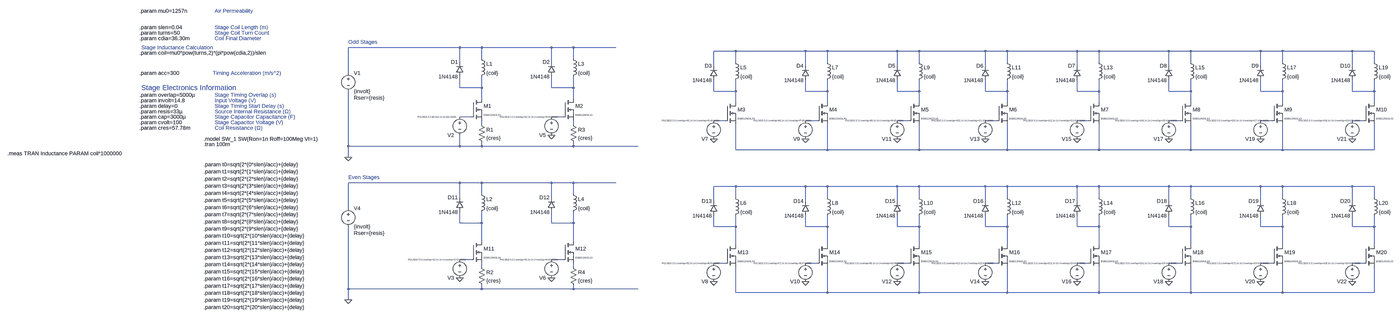
[diagram p0: schematic coilgun4-nmos.asc, whole sheet]
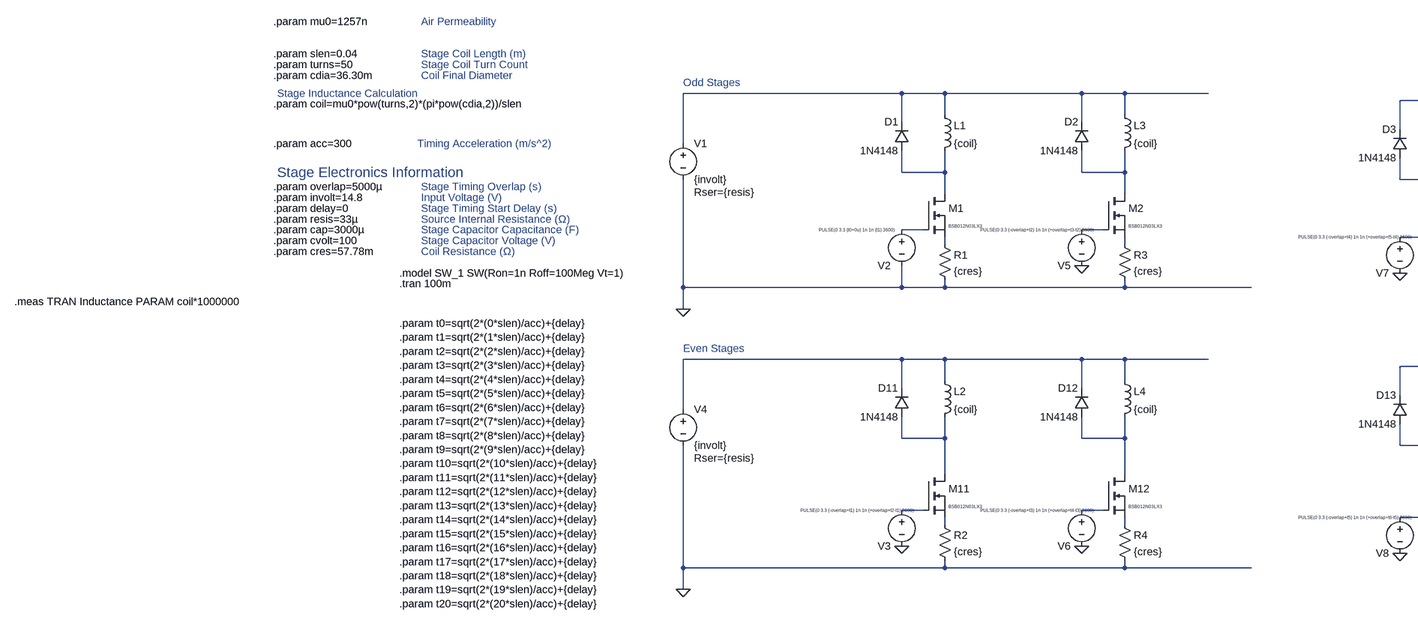
[diagram p1: schematic coilgun4-nmos.asc, part, row 1 of 1, column 1 of 2]
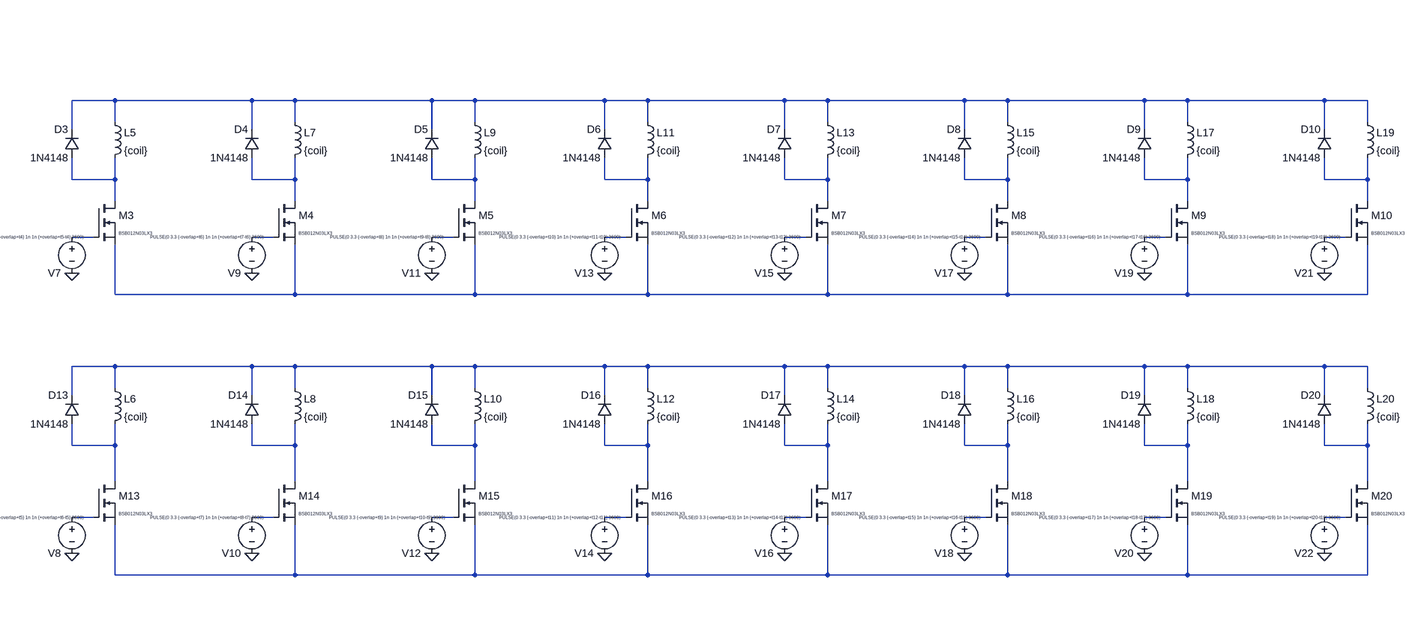
[diagram p2: schematic coilgun4-nmos.asc, part, row 1 of 1, column 2 of 2]
coilgun4-nmos.asc, the LTspice schematic file:
Version 4.1
SHEET 1 8016 1416
WIRE 288 -160 -288 -160
WIRE 384 -160 288 -160
WIRE 688 -160 384 -160
WIRE 784 -160 688 -160
WIRE 1088 -160 784 -160
WIRE 1968 -144 1872 -144
WIRE 2272 -144 1968 -144
WIRE 2368 -144 2272 -144
WIRE 2672 -144 2368 -144
WIRE 2768 -144 2672 -144
WIRE 3056 -144 2768 -144
WIRE 3152 -144 3056 -144
WIRE 3456 -144 3152 -144
WIRE 3552 -144 3456 -144
WIRE 3856 -144 3552 -144
WIRE 3952 -144 3856 -144
WIRE 4256 -144 3952 -144
WIRE 4352 -144 4256 -144
WIRE 4656 -144 4352 -144
WIRE 4752 -144 4656 -144
WIRE 384 -112 384 -160
WIRE 784 -112 784 -160
WIRE 288 -96 288 -160
WIRE 688 -96 688 -160
WIRE 1968 -96 1968 -144
WIRE 2368 -96 2368 -144
WIRE 2768 -96 2768 -144
WIRE 3152 -96 3152 -144
WIRE 3552 -96 3552 -144
WIRE 3952 -96 3952 -144
WIRE 4352 -96 4352 -144
WIRE 4752 -96 4752 -144
WIRE 1872 -80 1872 -144
WIRE 2272 -80 2272 -144
WIRE 2672 -80 2672 -144
WIRE 3056 -80 3056 -144
WIRE 3456 -80 3456 -144
WIRE 3856 -80 3856 -144
WIRE 4256 -80 4256 -144
WIRE 4656 -80 4656 -144
WIRE -288 -48 -288 -160
WIRE 288 16 288 -32
WIRE 384 16 384 -32
WIRE 384 16 288 16
WIRE 688 16 688 -32
WIRE 784 16 784 -32
WIRE 784 16 688 16
WIRE 1872 32 1872 -16
WIRE 1968 32 1968 -16
WIRE 1968 32 1872 32
WIRE 2272 32 2272 -16
WIRE 2368 32 2368 -16
WIRE 2368 32 2272 32
WIRE 2672 32 2672 -16
WIRE 2768 32 2768 -16
WIRE 2768 32 2672 32
WIRE 3056 32 3056 -16
WIRE 3152 32 3152 -16
WIRE 3152 32 3056 32
WIRE 3456 32 3456 -16
WIRE 3552 32 3552 -16
WIRE 3552 32 3456 32
WIRE 3856 32 3856 -16
WIRE 3952 32 3952 -16
WIRE 3952 32 3856 32
WIRE 4256 32 4256 -16
WIRE 4352 32 4352 -16
WIRE 4352 32 4256 32
WIRE 4656 32 4656 -16
WIRE 4752 32 4752 -16
WIRE 4752 32 4656 32
WIRE 384 64 384 16
WIRE 784 64 784 16
WIRE 1968 80 1968 32
WIRE 2368 80 2368 32
WIRE 2768 80 2768 32
WIRE 3152 80 3152 32
WIRE 3552 80 3552 32
WIRE 3952 80 3952 32
WIRE 4352 80 4352 32
WIRE 4752 80 4752 32
WIRE 336 144 288 144
WIRE 736 144 688 144
WIRE 1920 160 1872 160
WIRE 2320 160 2272 160
WIRE 2720 160 2672 160
WIRE 3104 160 3056 160
WIRE 3504 160 3456 160
WIRE 3904 160 3856 160
WIRE 4304 160 4256 160
WIRE 4704 160 4656 160
WIRE 384 176 384 160
WIRE 784 176 784 160
WIRE -288 272 -288 32
WIRE 288 272 288 224
WIRE 288 272 -288 272
WIRE 384 272 384 256
WIRE 384 272 288 272
WIRE 784 272 784 256
WIRE 784 272 384 272
WIRE 1184 272 784 272
WIRE 1968 288 1968 176
WIRE 2368 288 2368 176
WIRE 2368 288 1968 288
WIRE 2768 288 2768 176
WIRE 2768 288 2368 288
WIRE 3152 288 3152 176
WIRE 3152 288 2768 288
WIRE 3552 288 3552 176
WIRE 3552 288 3152 288
WIRE 3952 288 3952 176
WIRE 3952 288 3552 288
WIRE 4352 288 4352 176
WIRE 4352 288 3952 288
WIRE 4752 288 4752 176
WIRE 4752 288 4352 288
WIRE -288 320 -288 272
WIRE 288 432 -288 432
WIRE 384 432 288 432
WIRE 688 432 384 432
WIRE 784 432 688 432
WIRE 1088 432 784 432
WIRE 1968 448 1872 448
WIRE 2272 448 1968 448
WIRE 2368 448 2272 448
WIRE 2672 448 2368 448
WIRE 2768 448 2672 448
WIRE 3056 448 2768 448
WIRE 3152 448 3056 448
WIRE 3456 448 3152 448
WIRE 3552 448 3456 448
WIRE 3856 448 3552 448
WIRE 3952 448 3856 448
WIRE 4256 448 3952 448
WIRE 4352 448 4256 448
WIRE 4656 448 4352 448
WIRE 4752 448 4656 448
WIRE 384 480 384 432
WIRE 784 480 784 432
WIRE 288 496 288 432
WIRE 688 496 688 432
WIRE 1968 496 1968 448
WIRE 2368 496 2368 448
WIRE 2768 496 2768 448
WIRE 3152 496 3152 448
WIRE 3552 496 3552 448
WIRE 3952 496 3952 448
WIRE 4352 496 4352 448
WIRE 4752 496 4752 448
WIRE 1872 512 1872 448
WIRE 2272 512 2272 448
WIRE 2672 512 2672 448
WIRE 3056 512 3056 448
WIRE 3456 512 3456 448
WIRE 3856 512 3856 448
WIRE 4256 512 4256 448
WIRE 4656 512 4656 448
WIRE -288 544 -288 432
WIRE 288 608 288 560
WIRE 384 608 384 560
WIRE 384 608 288 608
WIRE 688 608 688 560
WIRE 784 608 784 560
WIRE 784 608 688 608
WIRE 1872 624 1872 576
WIRE 1968 624 1968 576
WIRE 1968 624 1872 624
WIRE 2272 624 2272 576
WIRE 2368 624 2368 576
WIRE 2368 624 2272 624
WIRE 2672 624 2672 576
WIRE 2768 624 2768 576
WIRE 2768 624 2672 624
WIRE 3056 624 3056 576
WIRE 3152 624 3152 576
WIRE 3152 624 3056 624
WIRE 3456 624 3456 576
WIRE 3552 624 3552 576
WIRE 3552 624 3456 624
WIRE 3856 624 3856 576
WIRE 3952 624 3952 576
WIRE 3952 624 3856 624
WIRE 4256 624 4256 576
WIRE 4352 624 4352 576
WIRE 4352 624 4256 624
WIRE 4656 624 4656 576
WIRE 4752 624 4752 576
WIRE 4752 624 4656 624
WIRE 384 688 384 608
WIRE 784 688 784 608
WIRE 1968 704 1968 624
WIRE 2368 704 2368 624
WIRE 2768 704 2768 624
WIRE 3152 704 3152 624
WIRE 3552 704 3552 624
WIRE 3952 704 3952 624
WIRE 4352 704 4352 624
WIRE 4752 704 4752 624
WIRE 336 768 288 768
WIRE 736 768 688 768
WIRE 1920 784 1872 784
WIRE 2320 784 2272 784
WIRE 2720 784 2672 784
WIRE 3104 784 3056 784
WIRE 3504 784 3456 784
WIRE 3904 784 3856 784
WIRE 4304 784 4256 784
WIRE 4704 784 4656 784
WIRE 384 800 384 784
WIRE 784 800 784 784
WIRE -288 896 -288 624
WIRE 384 896 384 880
WIRE 384 896 -288 896
WIRE 784 896 784 880
WIRE 784 896 384 896
WIRE 1184 896 784 896
WIRE 1968 912 1968 800
WIRE 2368 912 2368 800
WIRE 2368 912 1968 912
WIRE 2768 912 2768 800
WIRE 2768 912 2368 912
WIRE 3152 912 3152 800
WIRE 3152 912 2768 912
WIRE 3552 912 3552 800
WIRE 3552 912 3152 912
WIRE 3952 912 3952 800
WIRE 3952 912 3552 912
WIRE 4352 912 4352 800
WIRE 4352 912 3952 912
WIRE 4752 912 4752 800
WIRE 4752 912 4352 912
WIRE -288 944 -288 896
FLAG -288 320 0
FLAG -288 944 0
FLAG 688 224 0
FLAG 1872 240 0
FLAG 2272 240 0
FLAG 2672 240 0
FLAG 3056 240 0
FLAG 3456 240 0
FLAG 3856 240 0
FLAG 4256 240 0
FLAG 4656 240 0
FLAG 288 848 0
FLAG 688 848 0
FLAG 1872 864 0
FLAG 2272 864 0
FLAG 2672 864 0
FLAG 3056 864 0
FLAG 3456 864 0
FLAG 3856 864 0
FLAG 4256 864 0
FLAG 4656 864 0
SYMBOL voltage -288 -64 R0
WINDOW 123 0 0 Left 0
WINDOW 39 24 124 Left 2
SYMATTR SpiceLine Rser={resis}
SYMATTR InstName V1
SYMATTR Value {involt}
SYMBOL ind 368 -128 R0
SYMATTR InstName L1
SYMATTR Value {coil}
SYMBOL voltage 288 128 M0
WINDOW 0 24 96 Left 2
WINDOW 3 100 10 Top 0
WINDOW 123 0 0 Left 0
WINDOW 39 0 0 Left 0
SYMATTR InstName V2
SYMATTR Value PULSE(0 3.3 {t0+0u} 1n 1n {t1} 3600)
SYMBOL voltage 288 752 M0
WINDOW 0 24 96 Left 2
WINDOW 3 100 10 Top 0
WINDOW 123 0 0 Left 0
WINDOW 39 0 0 Left 0
SYMATTR InstName V3
SYMATTR Value PULSE(0 3.3 {-overlap+t1} 1n 1n {+overlap+t2-t1} 3600)
SYMBOL voltage -288 528 R0
WINDOW 123 0 0 Left 0
WINDOW 39 24 124 Left 2
SYMATTR SpiceLine Rser={resis}
SYMATTR InstName V4
SYMATTR Value {involt}
SYMBOL voltage 688 128 M0
WINDOW 0 24 96 Left 2
WINDOW 3 100 10 Top 0
WINDOW 123 0 0 Left 0
WINDOW 39 0 0 Left 0
SYMATTR InstName V5
SYMATTR Value PULSE(0 3.3 {-overlap+t2} 1n 1n {+overlap+t3-t2} 3600)
SYMBOL voltage 688 752 M0
WINDOW 0 24 96 Left 2
WINDOW 3 100 10 Top 0
WINDOW 123 0 0 Left 0
WINDOW 39 0 0 Left 0
SYMATTR InstName V6
SYMATTR Value PULSE(0 3.3 {-overlap+t3} 1n 1n {+overlap+t4-t3} 3600)
SYMBOL voltage 1872 144 M0
WINDOW 0 24 96 Left 2
WINDOW 3 100 10 Top 0
WINDOW 123 0 0 Left 0
WINDOW 39 0 0 Left 0
SYMATTR InstName V7
SYMATTR Value PULSE(0 3.3 {-overlap+t4} 1n 1n {+overlap+t5-t4} 3600)
SYMBOL voltage 1872 768 M0
WINDOW 0 24 96 Left 2
WINDOW 3 100 10 Top 0
WINDOW 123 0 0 Left 0
WINDOW 39 0 0 Left 0
SYMATTR InstName V8
SYMATTR Value PULSE(0 3.3 {-overlap+t5} 1n 1n {+overlap+t6-t5} 3600)
SYMBOL voltage 2272 144 M0
WINDOW 0 24 96 Left 2
WINDOW 3 100 10 Top 0
WINDOW 123 0 0 Left 0
WINDOW 39 0 0 Left 0
SYMATTR InstName V9
SYMATTR Value PULSE(0 3.3 {-overlap+t6} 1n 1n {+overlap+t7-t6} 3600)
SYMBOL voltage 2272 768 M0
WINDOW 0 24 96 Left 2
WINDOW 3 100 10 Top 0
WINDOW 123 0 0 Left 0
WINDOW 39 0 0 Left 0
SYMATTR InstName V10
SYMATTR Value PULSE(0 3.3 {-overlap+t7} 1n 1n {+overlap+t8-t7} 3600)
SYMBOL voltage 2672 144 M0
WINDOW 0 24 96 Left 2
WINDOW 3 100 10 Top 0
WINDOW 123 0 0 Left 0
WINDOW 39 0 0 Left 0
SYMATTR InstName V11
SYMATTR Value PULSE(0 3.3 {-overlap+t8} 1n 1n {+overlap+t9-t8} 3600)
SYMBOL voltage 2672 768 M0
WINDOW 0 24 96 Left 2
WINDOW 3 100 10 Top 0
WINDOW 123 0 0 Left 0
WINDOW 39 0 0 Left 0
SYMATTR InstName V12
SYMATTR Value PULSE(0 3.3 {-overlap+t9} 1n 1n {+overlap+t10-t9} 3600)
SYMBOL voltage 3056 144 M0
WINDOW 0 24 96 Left 2
WINDOW 3 100 10 Top 0
WINDOW 123 0 0 Left 0
WINDOW 39 0 0 Left 0
SYMATTR InstName V13
SYMATTR Value PULSE(0 3.3 {-overlap+t10} 1n 1n {+overlap+t11-t10} 3600)
SYMBOL voltage 3056 768 M0
WINDOW 0 24 96 Left 2
WINDOW 3 100 10 Top 0
WINDOW 123 0 0 Left 0
WINDOW 39 0 0 Left 0
SYMATTR InstName V14
SYMATTR Value PULSE(0 3.3 {-overlap+t11} 1n 1n {+overlap+t12-t11} 3600)
SYMBOL voltage 3456 144 M0
WINDOW 0 24 96 Left 2
WINDOW 3 100 10 Top 0
WINDOW 123 0 0 Left 0
WINDOW 39 0 0 Left 0
SYMATTR InstName V15
SYMATTR Value PULSE(0 3.3 {-overlap+t12} 1n 1n {+overlap+t13-t12} 3600)
SYMBOL voltage 3456 768 M0
WINDOW 0 24 96 Left 2
WINDOW 3 100 10 Top 0
WINDOW 123 0 0 Left 0
WINDOW 39 0 0 Left 0
SYMATTR InstName V16
SYMATTR Value PULSE(0 3.3 {-overlap+t13} 1n 1n {+overlap+t14-t13} 3600)
SYMBOL voltage 3856 144 M0
WINDOW 0 24 96 Left 2
WINDOW 3 100 10 Top 0
WINDOW 123 0 0 Left 0
WINDOW 39 0 0 Left 0
SYMATTR InstName V17
SYMATTR Value PULSE(0 3.3 {-overlap+t14} 1n 1n {+overlap+t15-t14} 3600)
SYMBOL voltage 3856 768 M0
WINDOW 0 24 96 Left 2
WINDOW 3 100 10 Top 0
WINDOW 123 0 0 Left 0
WINDOW 39 0 0 Left 0
SYMATTR InstName V18
SYMATTR Value PULSE(0 3.3 {-overlap+t15} 1n 1n {+overlap+t16-t15} 3600)
SYMBOL voltage 4256 144 M0
WINDOW 0 24 96 Left 2
WINDOW 3 100 10 Top 0
WINDOW 123 0 0 Left 0
WINDOW 39 0 0 Left 0
SYMATTR InstName V19
SYMATTR Value PULSE(0 3.3 {-overlap+t16} 1n 1n {+overlap+t17-t16} 3600)
SYMBOL voltage 4256 768 M0
WINDOW 0 24 96 Left 2
WINDOW 3 100 10 Top 0
WINDOW 123 0 0 Left 0
WINDOW 39 0 0 Left 0
SYMATTR InstName V20
SYMATTR Value PULSE(0 3.3 {-overlap+t17} 1n 1n {+overlap+t18-t17} 3600)
SYMBOL voltage 4656 144 M0
WINDOW 0 24 96 Left 2
WINDOW 3 100 10 Top 0
WINDOW 123 0 0 Left 0
WINDOW 39 0 0 Left 0
SYMATTR InstName V21
SYMATTR Value PULSE(0 3.3 {-overlap+t18} 1n 1n {+overlap+t19-t18} 3600)
SYMBOL voltage 4656 768 M0
WINDOW 0 24 96 Left 2
WINDOW 3 100 10 Top 0
WINDOW 123 0 0 Left 0
WINDOW 39 0 0 Left 0
SYMATTR InstName V22
SYMATTR Value PULSE(0 3.3 {-overlap+t19} 1n 1n {+overlap+t20-t19} 3600)
SYMBOL nmos 336 64 R0
WINDOW 3 56 72 Left 0
SYMATTR Value BSB012N03LX3
SYMATTR InstName M1
SYMBOL ind 768 -128 R0
SYMATTR InstName L3
SYMATTR Value {coil}
SYMBOL nmos 736 64 R0
WINDOW 3 56 72 Left 0
SYMATTR Value BSB012N03LX3
SYMATTR InstName M2
SYMBOL nmos 1920 80 R0
WINDOW 3 56 72 Left 0
SYMATTR Value BSB012N03LX3
SYMATTR InstName M3
SYMBOL nmos 2320 80 R0
WINDOW 3 56 72 Left 0
SYMATTR Value BSB012N03LX3
SYMATTR InstName M4
SYMBOL nmos 2720 80 R0
WINDOW 3 56 72 Left 0
SYMATTR Value BSB012N03LX3
SYMATTR InstName M5
SYMBOL nmos 3104 80 R0
WINDOW 3 56 72 Left 0
SYMATTR Value BSB012N03LX3
SYMATTR InstName M6
SYMBOL nmos 3504 80 R0
WINDOW 3 56 72 Left 0
SYMATTR Value BSB012N03LX3
SYMATTR InstName M7
SYMBOL nmos 3904 80 R0
WINDOW 3 56 72 Left 0
SYMATTR Value BSB012N03LX3
SYMATTR InstName M8
SYMBOL nmos 4304 80 R0
WINDOW 3 56 72 Left 0
SYMATTR Value BSB012N03LX3
SYMATTR InstName M9
SYMBOL nmos 4704 80 R0
WINDOW 3 56 72 Left 0
SYMATTR Value BSB012N03LX3
SYMATTR InstName M10
SYMBOL diode 304 -32 R180
WINDOW 0 24 64 Left 2
WINDOW 3 24 0 Left 2
SYMATTR InstName D1
SYMATTR Value 1N4148
SYMBOL diode 704 -32 R180
WINDOW 0 24 64 Left 2
WINDOW 3 24 0 Left 2
SYMATTR InstName D2
SYMATTR Value 1N4148
SYMBOL diode 1888 -16 R180
WINDOW 0 24 64 Left 2
WINDOW 3 24 0 Left 2
SYMATTR InstName D3
SYMATTR Value 1N4148
SYMBOL diode 2288 -16 R180
WINDOW 0 24 64 Left 2
WINDOW 3 24 0 Left 2
SYMATTR InstName D4
SYMATTR Value 1N4148
SYMBOL diode 2688 -16 R180
WINDOW 0 24 64 Left 2
WINDOW 3 24 0 Left 2
SYMATTR InstName D5
SYMATTR Value 1N4148
SYMBOL diode 3072 -16 R180
WINDOW 0 24 64 Left 2
WINDOW 3 24 0 Left 2
SYMATTR InstName D6
SYMATTR Value 1N4148
SYMBOL diode 3472 -16 R180
WINDOW 0 24 64 Left 2
WINDOW 3 24 0 Left 2
SYMATTR InstName D7
SYMATTR Value 1N4148
SYMBOL diode 3872 -16 R180
WINDOW 0 24 64 Left 2
WINDOW 3 24 0 Left 2
SYMATTR InstName D8
SYMATTR Value 1N4148
SYMBOL diode 4272 -16 R180
WINDOW 0 24 64 Left 2
WINDOW 3 24 0 Left 2
SYMATTR InstName D9
SYMATTR Value 1N4148
SYMBOL diode 4672 -16 R180
WINDOW 0 24 64 Left 2
WINDOW 3 24 0 Left 2
SYMATTR InstName D10
SYMATTR Value 1N4148
SYMBOL nmos 336 688 R0
WINDOW 3 56 72 Left 0
SYMATTR Value BSB012N03LX3
SYMATTR InstName M11
SYMBOL nmos 736 688 R0
WINDOW 3 56 72 Left 0
SYMATTR Value BSB012N03LX3
SYMATTR InstName M12
SYMBOL nmos 1920 704 R0
WINDOW 3 56 72 Left 0
SYMATTR Value BSB012N03LX3
SYMATTR InstName M13
SYMBOL nmos 2320 704 R0
WINDOW 3 56 72 Left 0
SYMATTR Value BSB012N03LX3
SYMATTR InstName M14
SYMBOL nmos 2720 704 R0
WINDOW 3 56 72 Left 0
SYMATTR Value BSB012N03LX3
SYMATTR InstName M15
SYMBOL nmos 3104 704 R0
WINDOW 3 56 72 Left 0
SYMATTR Value BSB012N03LX3
SYMATTR InstName M16
SYMBOL nmos 3504 704 R0
WINDOW 3 56 72 Left 0
SYMATTR Value BSB012N03LX3
SYMATTR InstName M17
SYMBOL nmos 3904 704 R0
WINDOW 3 56 72 Left 0
SYMATTR Value BSB012N03LX3
SYMATTR InstName M18
SYMBOL nmos 4304 704 R0
WINDOW 3 56 72 Left 0
SYMATTR Value BSB012N03LX3
SYMATTR InstName M19
SYMBOL nmos 4704 704 R0
WINDOW 3 56 72 Left 0
SYMATTR Value BSB012N03LX3
SYMATTR InstName M20
SYMBOL diode 304 560 R180
WINDOW 0 24 64 Left 2
WINDOW 3 24 0 Left 2
SYMATTR InstName D11
SYMATTR Value 1N4148
SYMBOL diode 704 560 R180
WINDOW 0 24 64 Left 2
WINDOW 3 24 0 Left 2
SYMATTR InstName D12
SYMATTR Value 1N4148
SYMBOL diode 1888 576 R180
WINDOW 0 24 64 Left 2
WINDOW 3 24 0 Left 2
SYMATTR InstName D13
SYMATTR Value 1N4148
SYMBOL diode 2288 576 R180
WINDOW 0 24 64 Left 2
WINDOW 3 24 0 Left 2
SYMATTR InstName D14
SYMATTR Value 1N4148
SYMBOL diode 2688 576 R180
WINDOW 0 24 64 Left 2
WINDOW 3 24 0 Left 2
SYMATTR InstName D15
SYMATTR Value 1N4148
SYMBOL diode 3072 576 R180
WINDOW 0 24 64 Left 2
WINDOW 3 24 0 Left 2
SYMATTR InstName D16
SYMATTR Value 1N4148
SYMBOL diode 3472 576 R180
WINDOW 0 24 64 Left 2
WINDOW 3 24 0 Left 2
SYMATTR InstName D17
SYMATTR Value 1N4148
SYMBOL diode 3872 576 R180
WINDOW 0 24 64 Left 2
WINDOW 3 24 0 Left 2
SYMATTR InstName D18
SYMATTR Value 1N4148
SYMBOL diode 4272 576 R180
WINDOW 0 24 64 Left 2
WINDOW 3 24 0 Left 2
SYMATTR InstName D19
SYMATTR Value 1N4148
SYMBOL diode 4672 576 R180
WINDOW 0 24 64 Left 2
WINDOW 3 24 0 Left 2
SYMATTR InstName D20
SYMATTR Value 1N4148
SYMBOL ind 1952 -112 R0
SYMATTR InstName L5
SYMATTR Value {coil}
SYMBOL ind 2352 -112 R0
SYMATTR InstName L7
SYMATTR Value {coil}
SYMBOL ind 2752 -112 R0
SYMATTR InstName L9
SYMATTR Value {coil}
SYMBOL ind 3136 -112 R0
SYMATTR InstName L11
SYMATTR Value {coil}
SYMBOL ind 3536 -112 R0
SYMATTR InstName L13
SYMATTR Value {coil}
SYMBOL ind 3936 -112 R0
SYMATTR InstName L15
SYMATTR Value {coil}
SYMBOL ind 4336 -112 R0
SYMATTR InstName L17
SYMATTR Value {coil}
SYMBOL ind 4736 -112 R0
SYMATTR InstName L19
SYMATTR Value {coil}
SYMBOL ind 368 464 R0
SYMATTR InstName L2
SYMATTR Value {coil}
SYMBOL ind 768 464 R0
SYMATTR InstName L4
SYMATTR Value {coil}
SYMBOL ind 1952 480 R0
SYMATTR InstName L6
SYMATTR Value {coil}
SYMBOL ind 2352 480 R0
SYMATTR InstName L8
SYMATTR Value {coil}
SYMBOL ind 2752 480 R0
SYMATTR InstName L10
SYMATTR Value {coil}
SYMBOL ind 3136 480 R0
SYMATTR InstName L12
SYMATTR Value {coil}
SYMBOL ind 3536 480 R0
SYMATTR InstName L14
SYMATTR Value {coil}
SYMBOL ind 3936 480 R0
SYMATTR InstName L16
SYMATTR Value {coil}
SYMBOL ind 4336 480 R0
SYMATTR InstName L18
SYMATTR Value {coil}
SYMBOL ind 4736 480 R0
SYMATTR InstName L20
SYMATTR Value {coil}
SYMBOL res 368 160 R0
SYMATTR InstName R1
SYMATTR Value {cres}
SYMBOL res 368 784 R0
SYMATTR InstName R2
SYMATTR Value {cres}
SYMBOL res 768 160 R0
SYMATTR InstName R3
SYMATTR Value {cres}
SYMBOL res 768 784 R0
SYMATTR InstName R4
SYMATTR Value {cres}
TEXT -288 -184 Left 2 ;Odd Stages
TEXT -288 408 Left 2 ;Even Stages
TEXT -1112 264 Left 2 !.tran 100m
TEXT -1112 240 Left 2 !.model SW_1 SW(Ron=1n Roff=100Meg Vt=1)
TEXT -1392 -136 Left 2 !.param coil=mu0*pow(turns,2)*(pi*pow(cdia,2))/slen
TEXT -1112 352 Left 2 !.param t0=sqrt(2*(0*slen)/acc)+{delay}\n.param t1=sqrt(2*(1*slen)/acc)+{delay}\n.param t2=sqrt(2*(2*slen)/acc)+{delay}\n.param t3=sqrt(2*(3*slen)/acc)+{delay}\n.param t4=sqrt(2*(4*slen)/acc)+{delay}\n.param t5=sqrt(2*(5*slen)/acc)+{delay}\n.param t6=sqrt(2*(6*slen)/acc)+{delay}\n.param t7=sqrt(2*(7*slen)/acc)+{delay}\n.param t8=sqrt(2*(8*slen)/acc)+{delay}\n.param t9=sqrt(2*(9*slen)/acc)+{delay}\n.param t10=sqrt(2*(10*slen)/acc)+{delay}\n.param t11=sqrt(2*(11*slen)/acc)+{delay}\n.param t12=sqrt(2*(12*slen)/acc)+{delay}\n.param t13=sqrt(2*(13*slen)/acc)+{delay}\n.param t14=sqrt(2*(14*slen)/acc)+{delay}\n.param t15=sqrt(2*(15*slen)/acc)+{delay}\n.param t16=sqrt(2*(16*slen)/acc)+{delay}\n.param t17=sqrt(2*(17*slen)/acc)+{delay}\n.param t18=sqrt(2*(18*slen)/acc)+{delay}\n.param t19=sqrt(2*(19*slen)/acc)+{delay}\n.param t20=sqrt(2*(20*slen)/acc)+{delay}
TEXT -1392 -48 Left 2 !.param acc=300
TEXT -1392 -248 Left 2 !.param slen=0.04
TEXT -1392 48 Left 2 !.param overlap=5000µ
TEXT -1392 72 Left 2 !.param involt=14.8
TEXT -1392 -320 Left 2 !.param mu0=1257n
TEXT -1968 304 Left 2 !.meas TRAN Inductance PARAM coil*1000000
TEXT -1392 96 Left 2 !.param delay=0
TEXT -1392 120 Left 2 !.param resis=33µ
TEXT -1392 144 Left 2 !.param cap=3000µ
TEXT -1064 48 Left 2 ;Stage Timing Overlap (s)
TEXT -1064 72 Left 2 ;Input Voltage (V)
TEXT -1064 96 Left 2 ;Stage Timing Start Delay (s)
TEXT -1064 120 Left 2 ;Source Internal Resistance (Ω)
TEXT -1064 144 Left 2 ;Stage Capacitor Capacitance (F)
TEXT -1064 -320 Left 2 ;Air Permeability
TEXT -1064 -248 Left 2 ;Stage Coil Length (m)
TEXT -1384 16 Left 3 ;Stage Electronics Information
TEXT -1064 -224 Left 2 ;Stage Coil Turn Count
TEXT -1072 -48 Left 2 ;Timing Acceleration (m/s^2)
TEXT -1392 -224 Left 2 !.param turns=50
TEXT -1392 -200 Left 2 !.param cdia=36.30m
TEXT -1384 -160 Left 2 ;Stage Inductance Calculation
TEXT -1064 -200 Left 2 ;Coil Final Diameter
TEXT -1392 192 Left 2 !.param cres=57.78m
TEXT -1064 192 Left 2 ;Coil Resistance (Ω)
TEXT -1392 168 Left 2 !.param cvolt=100
TEXT -1064 168 Left 2 ;Stage Capacitor Voltage (V)

The netlist it stands for:
* coilgun4-nmos.asc
V1 N001 0 {involt} Rser={resis}
L1 N001 N003 {coil}
V2 N013 0 PULSE(0 3.3 {t0+0u} 1n 1n {t1} 3600)
V3 N038 0 PULSE(0 3.3 {-overlap+t1} 1n 1n {+overlap+t2-t1} 3600)
V4 N026 0 {involt} Rser={resis}
V5 N014 0 PULSE(0 3.3 {-overlap+t2} 1n 1n {+overlap+t3-t2} 3600)
V6 N039 0 PULSE(0 3.3 {-overlap+t3} 1n 1n {+overlap+t4-t3} 3600)
V7 N015 0 PULSE(0 3.3 {-overlap+t4} 1n 1n {+overlap+t5-t4} 3600)
V8 N040 0 PULSE(0 3.3 {-overlap+t5} 1n 1n {+overlap+t6-t5} 3600)
V9 N016 0 PULSE(0 3.3 {-overlap+t6} 1n 1n {+overlap+t7-t6} 3600)
V10 N041 0 PULSE(0 3.3 {-overlap+t7} 1n 1n {+overlap+t8-t7} 3600)
V11 N017 0 PULSE(0 3.3 {-overlap+t8} 1n 1n {+overlap+t9-t8} 3600)
V12 N042 0 PULSE(0 3.3 {-overlap+t9} 1n 1n {+overlap+t10-t9} 3600)
V13 N018 0 PULSE(0 3.3 {-overlap+t10} 1n 1n {+overlap+t11-t10} 3600)
V14 N043 0 PULSE(0 3.3 {-overlap+t11} 1n 1n {+overlap+t12-t11} 3600)
V15 N019 0 PULSE(0 3.3 {-overlap+t12} 1n 1n {+overlap+t13-t12} 3600)
V16 N044 0 PULSE(0 3.3 {-overlap+t13} 1n 1n {+overlap+t14-t13} 3600)
V17 N020 0 PULSE(0 3.3 {-overlap+t14} 1n 1n {+overlap+t15-t14} 3600)
V18 N045 0 PULSE(0 3.3 {-overlap+t15} 1n 1n {+overlap+t16-t15} 3600)
V19 N021 0 PULSE(0 3.3 {-overlap+t16} 1n 1n {+overlap+t17-t16} 3600)
V20 N046 0 PULSE(0 3.3 {-overlap+t17} 1n 1n {+overlap+t18-t17} 3600)
V21 N022 0 PULSE(0 3.3 {-overlap+t18} 1n 1n {+overlap+t19-t18} 3600)
V22 N047 0 PULSE(0 3.3 {-overlap+t19} 1n 1n {+overlap+t20-t19} 3600)
M1 N003 N013 N023 N023 BSB012N03LX3
L3 N001 N004 {coil}
M2 N004 N014 N024 N024 BSB012N03LX3
M3 N005 N015 N025 N025 BSB012N03LX3
M4 N006 N016 N025 N025 BSB012N03LX3
M5 N007 N017 N025 N025 BSB012N03LX3
M6 N008 N018 N025 N025 BSB012N03LX3
M7 N009 N019 N025 N025 BSB012N03LX3
M8 N010 N020 N025 N025 BSB012N03LX3
M9 N011 N021 N025 N025 BSB012N03LX3
M10 N012 N022 N025 N025 BSB012N03LX3
D1 N003 N001 1N4148
D2 N004 N001 1N4148
D3 N005 N002 1N4148
D4 N006 N002 1N4148
D5 N007 N002 1N4148
D6 N008 N002 1N4148
D7 N009 N002 1N4148
D8 N010 N002 1N4148
D9 N011 N002 1N4148
D10 N012 N002 1N4148
M11 N028 N038 N048 N048 BSB012N03LX3
M12 N029 N039 N049 N049 BSB012N03LX3
M13 N030 N040 N050 N050 BSB012N03LX3
M14 N031 N041 N050 N050 BSB012N03LX3
M15 N032 N042 N050 N050 BSB012N03LX3
M16 N033 N043 N050 N050 BSB012N03LX3
M17 N034 N044 N050 N050 BSB012N03LX3
M18 N035 N045 N050 N050 BSB012N03LX3
M19 N036 N046 N050 N050 BSB012N03LX3
M20 N037 N047 N050 N050 BSB012N03LX3
D11 N028 N026 1N4148
D12 N029 N026 1N4148
D13 N030 N027 1N4148
D14 N031 N027 1N4148
D15 N032 N027 1N4148
D16 N033 N027 1N4148
D17 N034 N027 1N4148
D18 N035 N027 1N4148
D19 N036 N027 1N4148
D20 N037 N027 1N4148
L5 N002 N005 {coil}
L7 N002 N006 {coil}
L9 N002 N007 {coil}
L11 N002 N008 {coil}
L13 N002 N009 {coil}
L15 N002 N010 {coil}
L17 N002 N011 {coil}
L19 N002 N012 {coil}
L2 N026 N028 {coil}
L4 N026 N029 {coil}
L6 N027 N030 {coil}
L8 N027 N031 {coil}
L10 N027 N032 {coil}
L12 N027 N033 {coil}
L14 N027 N034 {coil}
L16 N027 N035 {coil}
L18 N027 N036 {coil}
L20 N027 N037 {coil}
R1 N023 0 {cres}
R2 N048 0 {cres}
R3 N024 0 {cres}
R4 N049 0 {cres}
.model D D
.lib standard.dio
.model NMOS NMOS
.model PMOS PMOS
.lib standard.mos
* Odd Stages
* Even Stages
.tran 100m
.model SW_1 SW(Ron=1n Roff=100Meg Vt=1)
.param coil=mu0*pow(turns,2)*(pi*pow(cdia,2))/slen
.param t0=sqrt(2*(0*slen)/acc)+{delay}
.param t1=sqrt(2*(1*slen)/acc)+{delay}
.param t2=sqrt(2*(2*slen)/acc)+{delay}
.param t3=sqrt(2*(3*slen)/acc)+{delay}
.param t4=sqrt(2*(4*slen)/acc)+{delay}
.param t5=sqrt(2*(5*slen)/acc)+{delay}
.param t6=sqrt(2*(6*slen)/acc)+{delay}
.param t7=sqrt(2*(7*slen)/acc)+{delay}
.param t8=sqrt(2*(8*slen)/acc)+{delay}
.param t9=sqrt(2*(9*slen)/acc)+{delay}
.param t10=sqrt(2*(10*slen)/acc)+{delay}
.param t11=sqrt(2*(11*slen)/acc)+{delay}
.param t12=sqrt(2*(12*slen)/acc)+{delay}
.param t13=sqrt(2*(13*slen)/acc)+{delay}
.param t14=sqrt(2*(14*slen)/acc)+{delay}
.param t15=sqrt(2*(15*slen)/acc)+{delay}
.param t16=sqrt(2*(16*slen)/acc)+{delay}
.param t17=sqrt(2*(17*slen)/acc)+{delay}
.param t18=sqrt(2*(18*slen)/acc)+{delay}
.param t19=sqrt(2*(19*slen)/acc)+{delay}
.param t20=sqrt(2*(20*slen)/acc)+{delay}
.param acc=300
.param slen=0.04
.param overlap=5000µ
.param involt=14.8
.param mu0=1257n
.meas TRAN Inductance PARAM coil*1000000
.param delay=0
.param resis=33µ
.param cap=3000µ
* Stage Timing Overlap (s)
* Input Voltage (V)
* Stage Timing Start Delay (s)
* Source Internal Resistance (Ω)
* Stage Capacitor Capacitance (F)
* Air Permeability
* Stage Coil Length (m)
* Stage Electronics Information
* Stage Coil Turn Count
* Timing Acceleration (m/s^2)
.param turns=50
.param cdia=36.30m
* Stage Inductance Calculation
* Coil Final Diameter
.param cres=57.78m
* Coil Resistance (Ω)
.param cvolt=100
* Stage Capacitor Voltage (V)
.backanno
.end